# EAGLE design pcf8574 (EAGLE 7.1.0)
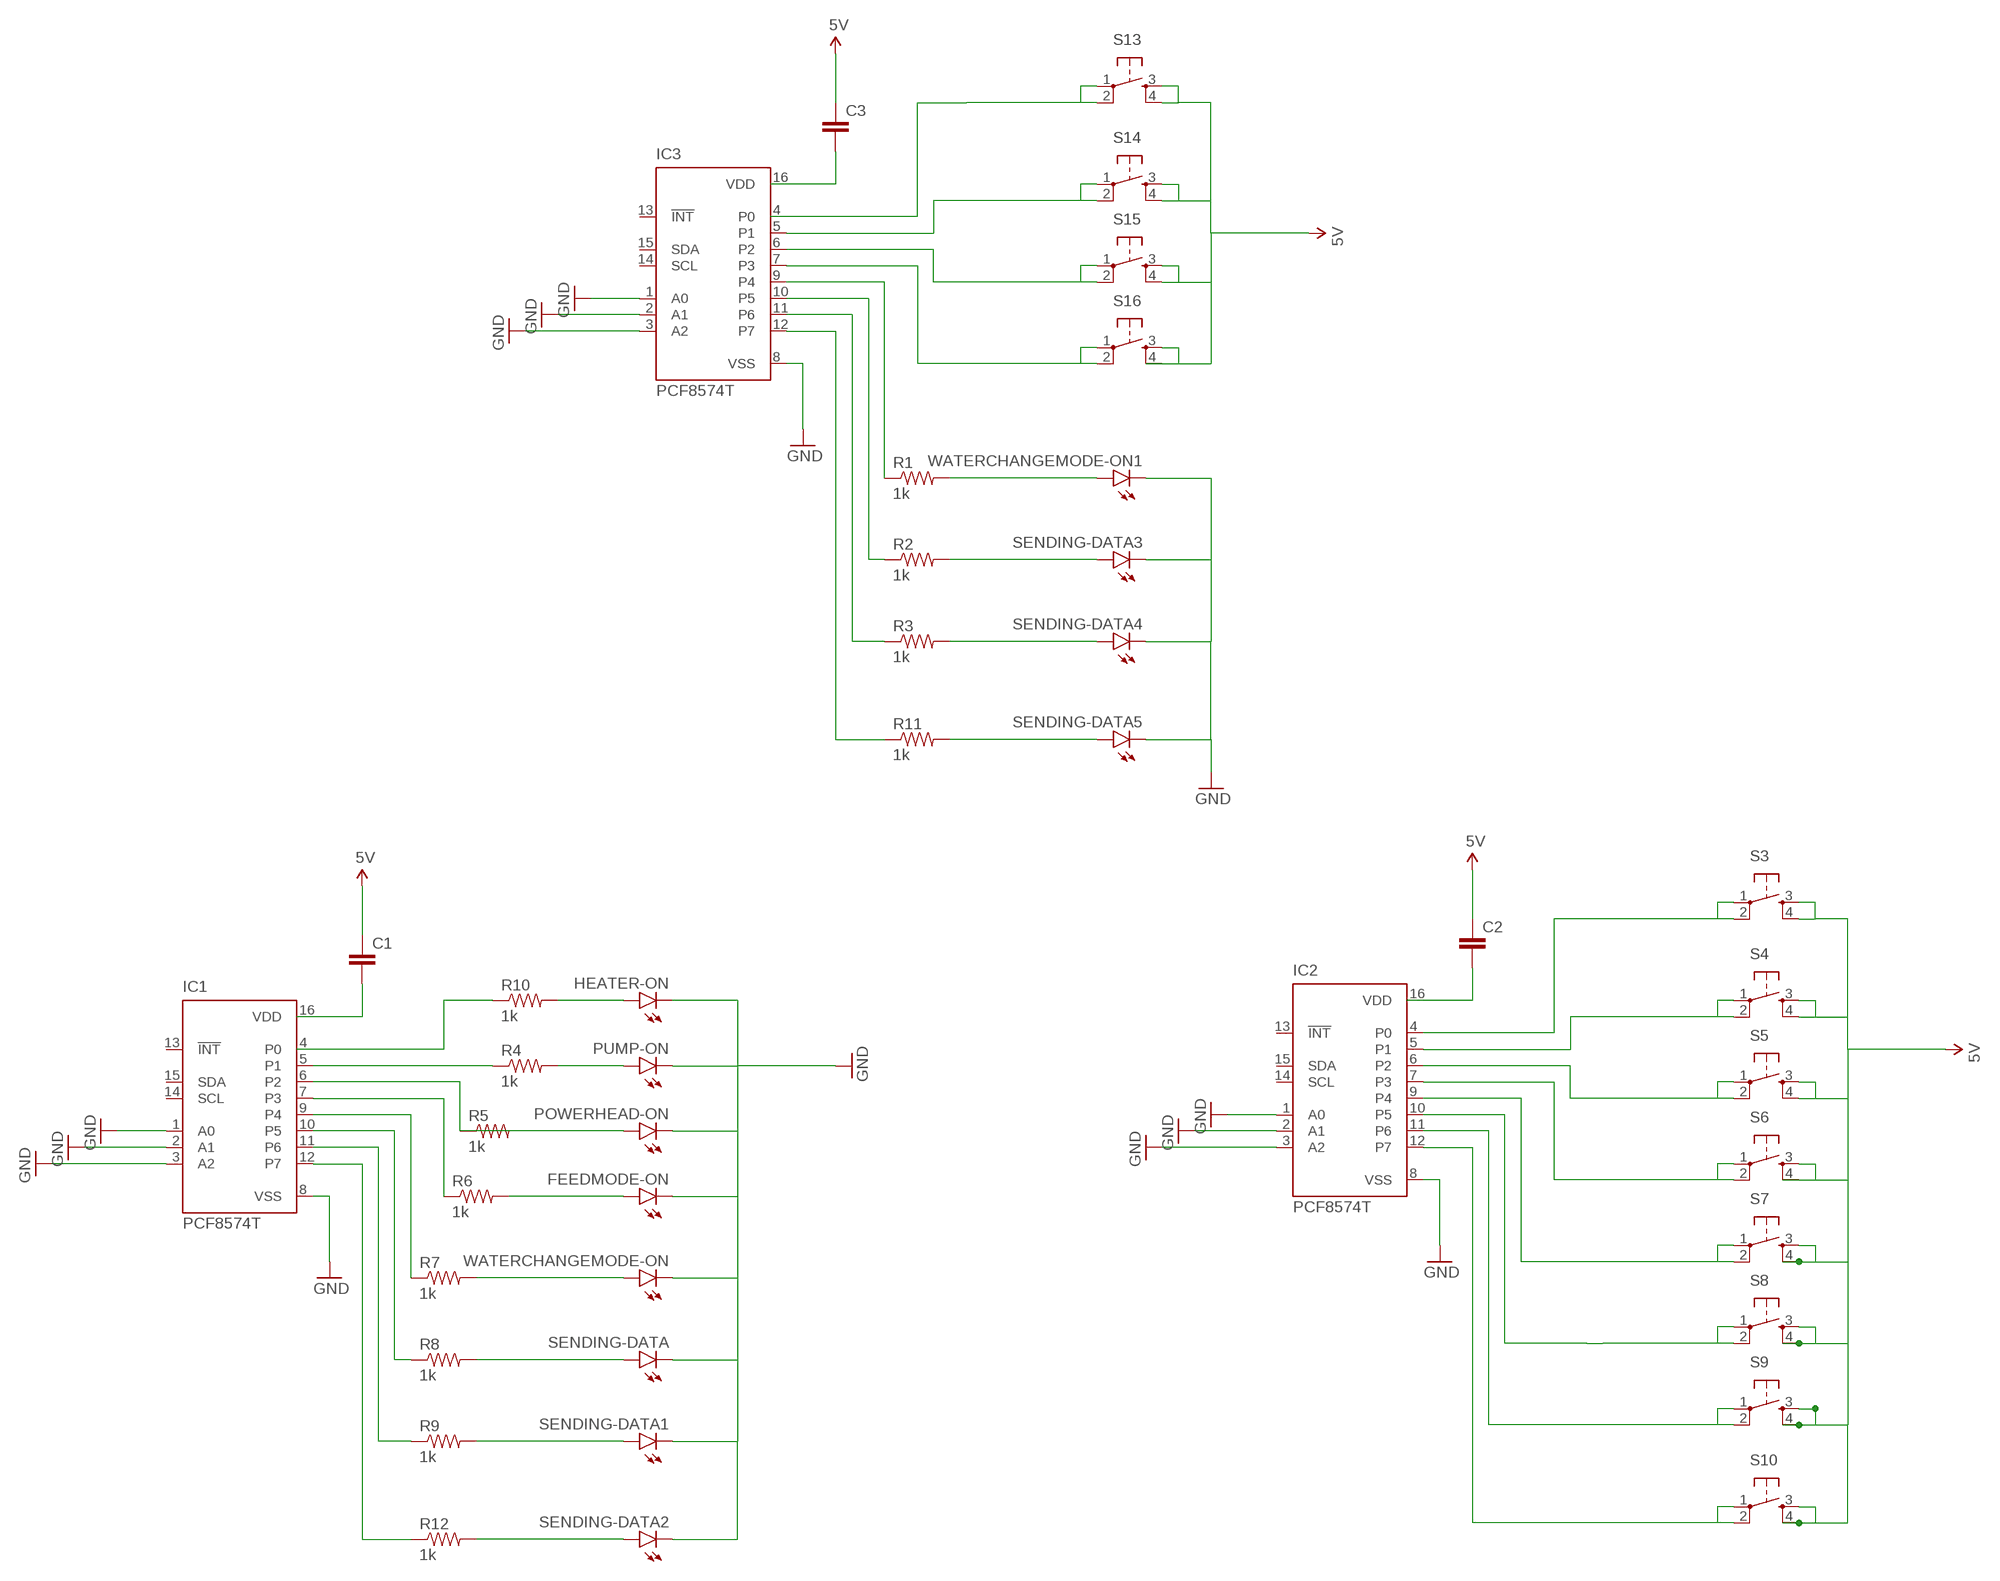
[diagram p0: schematic, sheet 1]

## Parts
C1  CAPPTH2  [CAP-PTH-SMALL2]
C2  CAPPTH2  [CAP-PTH-SMALL2]
C3  CAPPTH2  [CAP-PTH-SMALL2]
FEEDMODE-ON  LED3MM  [LED3MM]
HEATER-ON  LED3MM  [LED3MM]
IC1  PCF8574T  [SO16W]
IC2  PCF8574T  [SO16W]
IC3  PCF8574T  [SO16W]
POWERHEAD-ON  LED3MM  [LED3MM]
PUMP-ON  LED3MM  [LED3MM]
R1  1k  RESISTORAXIAL-0.3  [AXIAL-0.3]
R2  1k  RESISTORAXIAL-0.3  [AXIAL-0.3]
R3  1k  RESISTORAXIAL-0.3  [AXIAL-0.3]
R4  1k  RESISTORAXIAL-0.3  [AXIAL-0.3]
R5  1k  RESISTORAXIAL-0.3  [AXIAL-0.3]
R6  1k  RESISTORAXIAL-0.3  [AXIAL-0.3]
R7  1k  RESISTORAXIAL-0.3  [AXIAL-0.3]
R8  1k  RESISTORAXIAL-0.3  [AXIAL-0.3]
R9  1k  RESISTORAXIAL-0.3  [AXIAL-0.3]
R10  1k  RESISTORAXIAL-0.3  [AXIAL-0.3]
R11  1k  RESISTORAXIAL-0.3  [AXIAL-0.3]
R12  1k  RESISTORAXIAL-0.3  [AXIAL-0.3]
S3  TAC_SWITCHPTH  [TACTILE-PTH]
S4  TAC_SWITCHPTH  [TACTILE-PTH]
S5  TAC_SWITCHPTH  [TACTILE-PTH]
S6  TAC_SWITCHPTH  [TACTILE-PTH]
S7  TAC_SWITCHPTH  [TACTILE-PTH]
S8  TAC_SWITCHPTH  [TACTILE-PTH]
S9  TAC_SWITCHPTH  [TACTILE-PTH]
S10  TAC_SWITCHPTH  [TACTILE-PTH]
S13  TAC_SWITCHPTH  [TACTILE-PTH]
S14  TAC_SWITCHPTH  [TACTILE-PTH]
S15  TAC_SWITCHPTH  [TACTILE-PTH]
S16  TAC_SWITCHPTH  [TACTILE-PTH]
SENDING-DATA  LED3MM  [LED3MM]
SENDING-DATA1  LED3MM  [LED3MM]
SENDING-DATA2  LED3MM  [LED3MM]
SENDING-DATA3  LED3MM  [LED3MM]
SENDING-DATA4  LED3MM  [LED3MM]
SENDING-DATA5  LED3MM  [LED3MM]
WATERCHANGEMODE-ON  LED3MM  [LED3MM]
WATERCHANGEMODE-ON1  LED3MM  [LED3MM]

## Nets
5V: C1.1 C2.1 C3.1 S3.3 S3.4 S4.3 S4.4 S5.3 S5.4 S6.3 S6.4 S7.3 S7.4 S8.3 S8.4 S9.3 S9.4 S10.3 S10.4 S13.3 S13.4 S14.3 S14.4 S15.3 S15.4 S16.3 S16.4
GND: FEEDMODE-ON.K(C) HEATER-ON.K(C) IC1.1(A0) IC1.2(A1) IC1.3(A2) IC1.8(VSS) IC2.1(A0) IC2.2(A1) IC2.3(A2) IC2.8(VSS) IC3.1(A0) IC3.2(A1) IC3.3(A2) IC3.8(VSS) POWERHEAD-ON.K(C) PUMP-ON.K(C) SENDING-DATA1.K(C) SENDING-DATA2.K(C) SENDING-DATA3.K(C) SENDING-DATA4.K(C) SENDING-DATA5.K(C) SENDING-DATA.K(C) WATERCHANGEMODE-ON1.K(C) WATERCHANGEMODE-ON.K(C)
N$1: PUMP-ON.A R4.P$2
N$2: HEATER-ON.A R10.P$2
N$3: R9.P$2 SENDING-DATA1.A
N$4: R12.P$2 SENDING-DATA2.A
N$5: R8.P$2 SENDING-DATA.A
N$6: R7.P$2 WATERCHANGEMODE-ON.A
N$7: IC1.12(P7) R12.P$1
N$8: IC1.11(P6) R9.P$1
N$9: IC1.10(P5) R8.P$1
N$10: IC1.9(P4) R7.P$1
N$11: IC1.7(P3) R6.P$1
N$12: FEEDMODE-ON.A R6.P$2
N$13: IC1.6(P2) POWERHEAD-ON.A R5.P$1 R5.P$2
N$14: R10.P$1
N$15: IC1.5(P1) R4.P$1
N$16: C1.2
N$17: IC2.11(P6) S9.1 S9.2
N$18: IC2.12(P7) S10.1 S10.2
N$19: S8.1 S8.2
N$20: IC2.9(P4) S7.1 S7.2
N$21: IC3.11(P6) R3.P$1
N$22: IC3.12(P7) R11.P$1
N$23: IC2.10(P5)
N$25: IC3.9(P4) R1.P$1
N$26: IC2.7(P3) S6.1 S6.2
N$27: IC3.10(P5) R2.P$1
N$28: IC2.5(P1) S4.1 S4.2
N$29: IC2.4(P0) S3.1 S3.2
N$30: IC3.7(P3) S16.1 S16.2
N$31: IC3.5(P1) S14.1 S14.2
N$32: C2.2
N$33: IC2.6(P2) S5.1 S5.2
N$35: S13.1 S13.2
N$36: C3.2
N$37: IC3.6(P2) S15.1 S15.2
N$39: R3.P$2 SENDING-DATA4.A
N$43: R11.P$2 SENDING-DATA5.A
N$44: R2.P$2 SENDING-DATA3.A
N$45: R1.P$2 WATERCHANGEMODE-ON1.A
Unconnected: IC1.4(P0) IC1.13(!INT) IC1.14(SCL) IC1.15(SDA) IC2.13(!INT) IC2.14(SCL) IC2.15(SDA) IC3.4(P0) IC3.13(!INT) IC3.14(SCL) IC3.15(SDA)

## Power pins joined to a net without a drawn wire
VDD: IC1.16(VDD) IC2.16(VDD) IC3.16(VDD)

## Library data of the parts
C1-C3 = SparkFun-Capacitors:CAP: Capacitor Standard 0603 ceramic capacitor, and 0.1" leaded capacitor.
FEEDMODE-ON HEATER-ON POWERHEAD-ON PUMP-ON SENDING-DATA SENDING-DATA1-SENDING-DATA5 WATERCHANGEMODE-ON WATERCHANGEMODE-ON1 = SparkFun-LED:LED: LEDs Standard schematic elements and footprints for 5mm, 3mm, 1206, and 0603 sized LEDs. 5mm - Spark Fun Electronics SKU : COM-00529 (and others)
IC1-IC3 = micro-philips:PCF8574: I2C-Bus Remote 8-bit I/O expander http://www.semiconductors.philips.com/acrobat_download/datasheets/PCF8574_4.pdf
R1-R12 = SparkFun-Resistors:RESISTOR: Resistor Basic schematic elements and footprints for 0603, 1206, and PTH resistors.
S3-S10 S13-S16 = SparkFun-Electromechanical:TAC_SWITCH: Momentary Switch Button commonly used for reset or general input. Spark Fun Electronics SKU : COM-00097 SMT- SWCH-08247

## Board
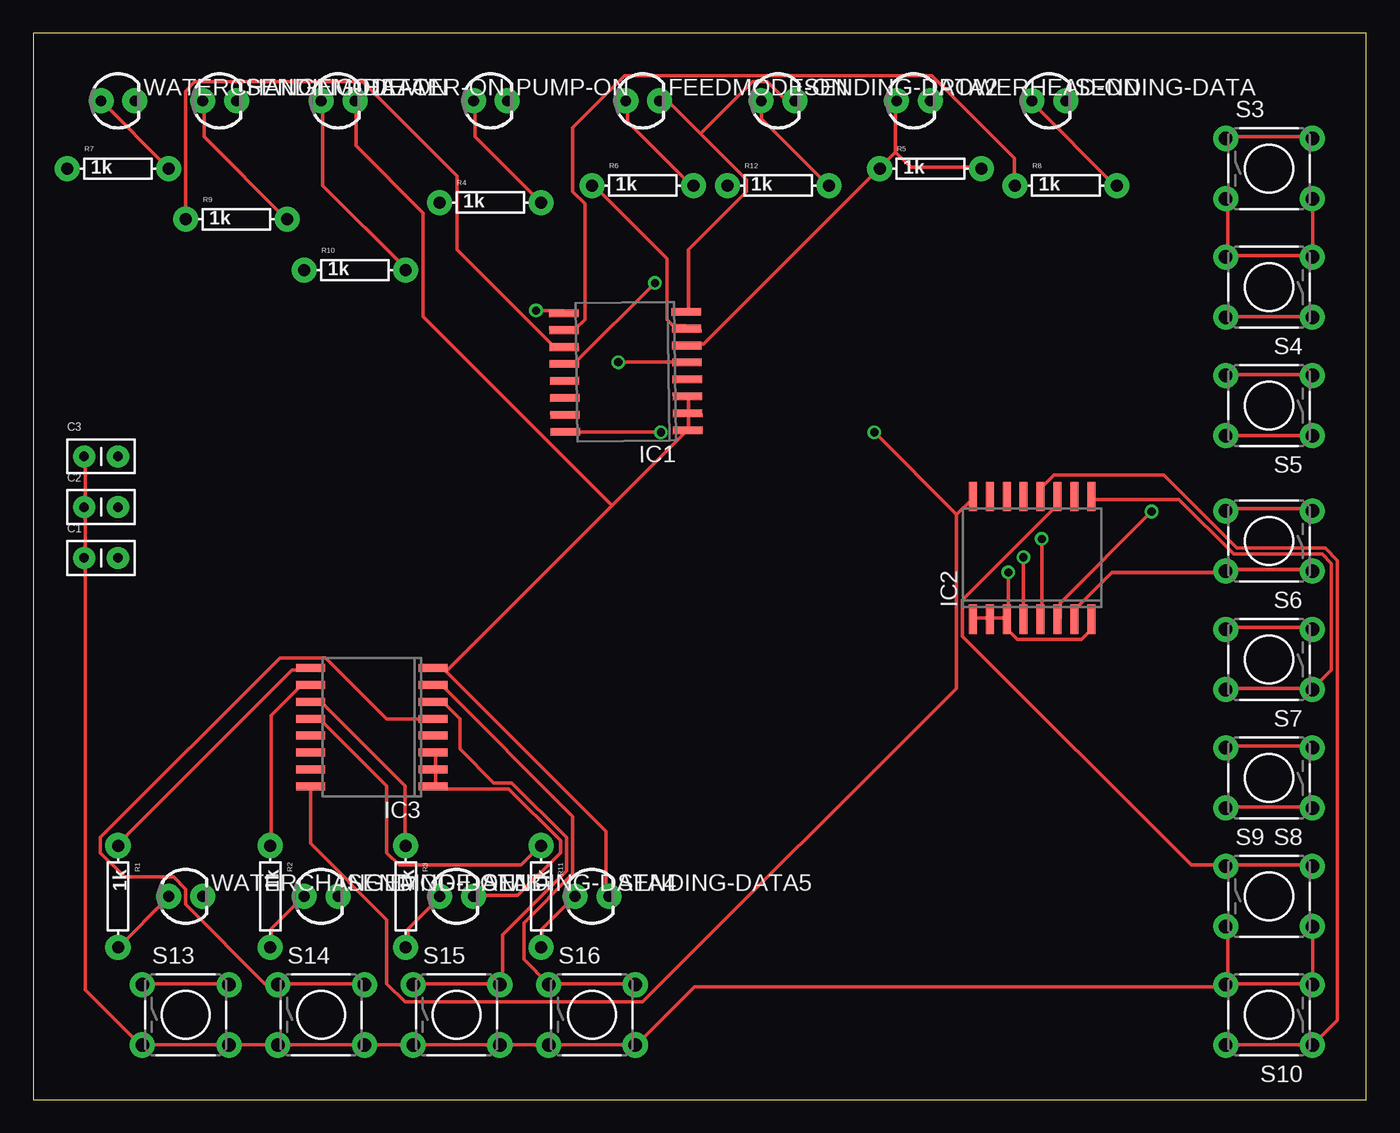
[diagram p1: board, top side]
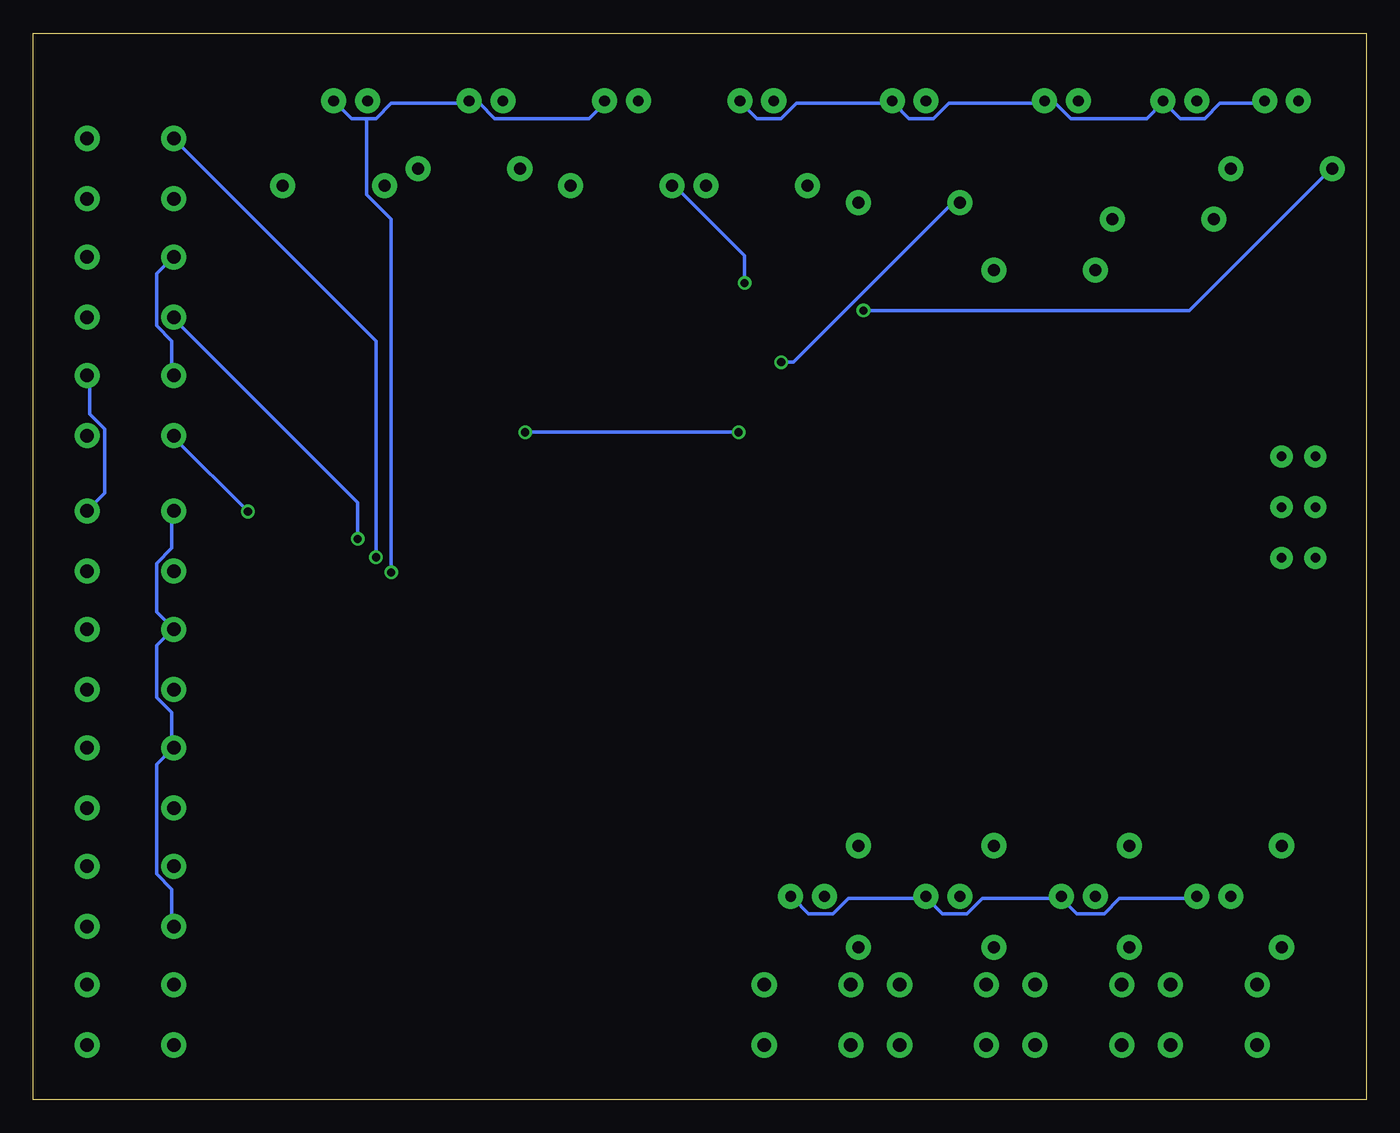
[diagram p2: board, bottom side, seen from below]

Size 100 x 80 mm. Coordinates in mm from the lower left corner, seen from the top.
Outline: 0,0 100,0 100,80 0,80 0,0
Copper layers (1*16): Top 0.035mm / dielectric 1.5mm / Bottom 0.035mm
Design rules "default": minimum track width 10mil, minimum drill 24mil, track to track 8mil, track to pad 8mil, pad to pad 8mil, via to via 8mil, smd to smd 8mil, copper to edge 40mil, drill to drill 8mil, minimum pad ring 10mil, minimum via ring 8mil, stop-mask expansion 4mil, vias tented up to drill 0mil, thermal gap 10mil

### Footprints (pad centres in the part's own frame; a part is rotated, then mirrored left to right if it is on the bottom)
CAP-PTH-SMALL2 = drill 0.7 pad 1.651: 1 0,0; 2 2.54,0
LED3MM = drill 0.813 pad 1.88: A -1.27,0; K 1.27,0
SO16W = smd 0.6 x 2.2: 1 -4.445,-4.6; 2 -3.175,-4.6; 3 -1.905,-4.6; 4 -0.635,-4.6; 5 0.635,-4.6; 6 1.905,-4.6; 7 3.175,-4.6; 8 4.445,-4.6; 9 4.445,4.6; 10 3.175,4.6; 11 1.905,4.6; 12 0.635,4.6; 13 -0.635,4.6; 14 -1.905,4.6; 15 -3.175,4.6; 16 -4.445,4.6
AXIAL-0.3 = drill 0.9 pad 1.88: P$1 -3.81,0; P$2 3.81,0
TACTILE-PTH = drill 1.016 pad 1.88: 1 -3.251,2.261; 2 3.251,2.261; 3 -3.251,-2.261; 4 3.251,-2.261

### Placement (x,y rotation side)
C1  3.81,40.64 0 top
C2  3.81,44.45 0 top
C3  3.81,48.26 0 top
FEEDMODE-ON  45.72,74.93 0 top
HEATER-ON  22.86,74.93 0 top
IC1  44.45,54.61 90.7 top
IC2  74.93,40.64 0 top
IC3  25.4,27.94 90 top
POWERHEAD-ON  66.04,74.93 0 top
PUMP-ON  34.29,74.93 0 top
R1  6.35,15.24 270 top
R2  17.78,15.24 270 top
R3  27.94,15.24 270 top
R4  34.29,67.31 0 top
R5  67.31,69.85 0 top
R6  45.72,68.58 0 top
R7  6.35,69.85 0 top
R8  77.47,68.58 0 top
R9  15.24,66.04 0 top
R10  24.13,62.23 0 top
R11  38.1,15.24 270 top
R12  55.88,68.58 0 top
S3  92.71,69.85 0 top
S4  92.71,60.96 180 top
S5  92.71,52.07 180 top
S6  92.71,41.91 180 top
S7  92.71,33.02 180 top
S8  92.71,24.13 180 top
S9  92.71,15.24 0 top
S10  92.71,6.35 180 top
S13  11.43,6.35 0 top
S14  21.59,6.35 0 top
S15  31.75,6.35 0 top
S16  41.91,6.35 0 top
SENDING-DATA  76.2,74.93 0 top
SENDING-DATA1  13.97,74.93 0 top
SENDING-DATA2  55.88,74.93 0 top
SENDING-DATA3  21.59,15.24 0 top
SENDING-DATA4  31.75,15.24 0 top
SENDING-DATA5  41.91,15.24 0 top
WATERCHANGEMODE-ON  6.35,74.93 0 top
WATERCHANGEMODE-ON1  11.43,15.24 0 top

### Tracks (layer width: path | path; a pad name or v marks a point on that pad's centre or on a via)
5V
  Top 0.254: S5.4 89.61,54.41 95.78,54.41 S5.3 | 89.61,63.32 89.61,67.44 S3.3 | S3.4 96.01,67.44 96.01,63.32 S4.3 95.78,63.32 89.61,63.32 | 89.61,63.32 S4.4 | 89.61,8.69 89.61,12.8 S9.3 | S9.4 96.01,12.8 96.01,8.69 S10.3 95.78,8.69 89.61,8.69 | 89.61,8.69 S10.4 89.38,8.46 49.61,8.46 45.26,4.12 S16.4 45.03,4.12 38.86,4.12 S16.3 38.63,4.12 35.2,4.12 S15.4 34.98,4.12 28.57,4.12 S15.3 28.35,4.12 24.92,4.12 S14.4 24.69,4.12 18.52,4.12 S14.3 18.29,4.12 14.86,4.12 S13.4 14.63,4.12 8.23,4.12 S13.3 8,4.12 3.89,8.23 3.89,40.46 C1.1 3.89,40.69 3.89,44.35 C2.1 3.89,44.58 3.89,48.23 C3.1 | S6.4 89.61,44.35 95.78,44.35 S6.3 | S8.4 89.61,26.52 95.78,26.52 S8.3 | S7.4 89.61,35.43 95.78,35.43 S7.3
  Bottom 0.254: S5.4 89.61,54.41 89.61,56.92 90.75,58.06 90.75,61.95 89.61,63.09 S4.4 | S6.4 89.61,44.12 89.61,41.38 90.75,40.23 90.75,36.58 S7.4 89.61,35.2 90.75,34.06 90.75,30.18 89.61,29.03 89.61,26.52 S8.4 89.61,26.29 90.75,25.15 90.75,16.92 89.61,15.77 89.61,13.03 S9.3 | S6.3 94.64,45.49 94.64,50.29 95.78,51.44 95.78,54.18 S5.3
GND  (via drill 0.61)
  Top 0.254: IC3.3 30.18,25.83 30.18,24.92 IC3.2 30.18,24.69 30.18,23.55 IC3.1 30.18,23.32 35.66,23.32 39.55,19.43 39.55,18.52 36.35,15.32 33.15,15.32 SENDING-DATA4.K | IC1.3 49.15,52.58 49.15,51.66 IC1.2 49.15,51.44 49.15,50.29 IC1.1 48.92,50.06 43.43,44.58 | 30.86,32.23 30.18,32.23 IC3.8 30.86,32.23 | 30.86,32.23 42.98,20.12 42.98,15.32 SENDING-DATA5.K | 43.43,44.58 31.09,32.23 30.86,32.23 | IC2.1 70.64,36.12 71.55,36.12 IC2.2 71.78,36.12 72.92,36.12 IC2.3 | IC2.8 79.32,35.89 79.32,35.2 78.64,34.52 73.84,34.52 73.15,35.2 73.15,35.89 IC2.3 | v73.15,39.55 73.15,36.12 IC2.3 | 50.06,72.47 47.78,74.75 47.09,74.75 FEEDMODE-ON.K | 50.06,72.47 53.49,69.04 53.49,68.12 49.15,63.78 49.15,59.21 IC1.8 | 50.06,72.47 53.95,76.35 55.09,76.35 56.46,74.98 57.15,74.98 SENDING-DATA2.K | 43.43,44.58 29.26,58.75 29.26,66.52 24.23,71.55 24.23,74.75 HEATER-ON.K
  Bottom 0.254: 22.86,15.09 21.72,13.95 19.66,13.95 18.52,15.09 12.8,15.09 WATERCHANGEMODE-ON1.K | 22.86,15.09 28.8,15.09 29.95,13.95 31.77,13.95 32.92,15.09 SENDING-DATA4.K 33.15,15.09 38.86,15.09 40.01,13.95 41.83,13.95 42.98,15.09 SENDING-DATA5.K | 22.86,15.09 SENDING-DATA3.K | 74.98,73.61 76.12,73.61 77.27,74.75 SENDING-DATA.K | 74.98,73.61 74.3,73.61 73.15,74.75 67.44,74.75 POWERHEAD-ON.K 67.21,74.75 66.52,74.75 65.38,73.61 58.29,73.61 57.15,74.75 SENDING-DATA2.K | v73.15,39.55 73.15,66.06 74.98,67.89 74.98,73.61 | WATERCHANGEMODE-ON.K 7.77,74.75 10.97,74.75 12.12,73.61 13.95,73.61 15.09,74.75 SENDING-DATA1.K 15.32,74.75 16.46,73.61 22.17,73.61 23.32,74.75 24,74.75 HEATER-ON.K 24.23,74.75 31.32,74.75 32.46,73.61 34.29,73.61 35.43,74.75 PUMP-ON.K 35.66,74.75 42.75,74.75 43.89,73.61 45.72,73.61 46.86,74.75 FEEDMODE-ON.K
N$1
  Top 0.254: PUMP-ON.A 33.15,74.75 33.15,72.24 37.95,67.44 R4.P$2
N$2
  Top 0.254: HEATER-ON.A 21.72,74.75 21.72,68.58 27.89,62.41 R10.P$2
N$3
  Top 0.254: SENDING-DATA1.A 12.8,74.75 12.8,72.24 18.97,66.06 R9.P$2
N$4
  Top 0.254: SENDING-DATA2.A 54.63,74.75 54.63,73.61 59.66,68.58 R12.P$2
N$5
  Top 0.254: R8.P$2 81.15,68.58 74.98,74.75 SENDING-DATA.A
N$6
  Top 0.254: R7.P$2 WATERCHANGEMODE-ON.A
N$7  (via drill 0.61)
  Top 0.254: v46.63,61.27 40.69,55.32 40.01,55.32 IC1.12
  Bottom 0.254: v46.63,61.27 46.63,63.32 51.89,68.58 R12.P$1
N$8
  Top 0.254: R9.P$1 11.43,75.67 12.12,76.35 24.69,76.35 31.77,69.27 31.77,63.78 39.09,56.46 39.78,56.46 IC1.11
N$9
  Top 0.254: IC1.10 40.01,57.84 40.69,57.84 41.38,58.52 41.38,67.21 40.46,68.12 40.46,72.92 44.35,76.81 67.44,76.81 73.61,70.64 73.61,68.58 R8.P$1
N$10  (via drill 0.61)
  Top 0.254: v37.72,59.21 39.78,59.21 IC1.9
  Bottom 0.254: v37.72,59.21 13.26,59.21 2.74,69.72 R7.P$1
N$11
  Top 0.254: IC1.7 48.92,58.06 48.01,58.06 47.55,58.52 47.55,63.09 42.06,68.58 R6.P$1
N$12
  Top 0.254: FEEDMODE-ON.A 44.58,74.75 44.58,73.38 49.38,68.58 R6.P$2
N$13
  Top 0.254: IC1.6 49.15,56.69 50.29,56.69 63.32,69.72 R5.P$1 63.55,69.95 64.69,71.09 | 64.69,71.09 64.69,74.75 POWERHEAD-ON.A | 64.69,71.09 65.84,69.95 71.09,69.95 R5.P$2
N$15  (via drill 0.61)
  Top 0.254: v43.89,55.32 48.92,55.32 IC1.5
  Bottom 0.254: v43.89,55.32 42.98,55.32 31.09,67.21 30.63,67.21 R4.P$1
N$17
  Top 0.254: IC2.11 76.81,45.03 76.81,44.58 69.72,37.49 69.72,34.75 86.87,17.6 89.38,17.6 S9.1 89.61,17.6 95.78,17.6 S9.2
N$18
  Top 0.254: IC2.12 75.67,45.26 75.67,45.95 76.58,46.86 84.81,46.86 90.3,41.38 96.93,41.38 97.84,40.46 97.84,5.94 96.01,4.12 S10.1 95.78,4.12 89.61,4.12 S10.2
N$19
  Top 0.254: S8.2 89.61,21.95 95.78,21.95 S8.1
N$20
  Top 0.254: IC2.9 79.55,45.03 85.95,45.03 90.07,40.92 96.7,40.92 97.38,40.23 97.38,32.23 96.01,30.86 S7.1 95.78,30.86 89.61,30.86 S7.2
N$21
  Top 0.254: IC3.11 20.8,29.72 21.72,29.72 27.89,23.55 27.89,19.2 R3.P$1
N$22
  Top 0.254: IC3.12 21.49,28.57 26.52,23.55 26.52,18.52 27.43,17.6 36.58,17.6 37.95,18.97 R11.P$1
N$25
  Top 0.254: IC3.9 20.57,32.23 19.43,32.23 6.4,19.2 R1.P$1
N$26
  Top 0.254: IC2.7 78.18,36.12 78.18,36.8 80.92,39.55 89.38,39.55 S6.2 89.61,39.78 95.78,39.78 S6.1
N$27
  Top 0.254: IC3.10 20.57,31.09 20.12,31.09 17.83,28.8 17.83,19.2 R2.P$1
N$28  (via drill 0.61)
  Top 0.254: v75.67,42.06 75.67,36.12 IC2.5 | S4.1 95.78,58.75 89.61,58.75 S4.2
  Bottom 0.254: v75.67,42.06 75.67,44.81 89.38,58.52 S4.2
N$29  (via drill 0.61)
  Top 0.254: v74.3,40.69 IC2.4 | S3.2 95.78,72.24 89.61,72.24 S3.1
  Bottom 0.254: v74.3,40.69 74.3,56.92 89.38,72.01 S3.1
N$30
  Top 0.254: IC3.7 30.18,31.09 30.63,31.09 40.46,21.26 40.46,16.92 36.8,13.26 36.8,10.52 38.63,8.69 S16.1 38.86,8.69 45.03,8.69 S16.2
N$31
  Top 0.254: IC3.5 26.52,28.57 21.95,33.15 18.52,33.15 5.03,19.66 5.03,18.52 6.86,16.69 10.52,16.69 11.43,15.77 11.43,14.63 17.37,8.69 18.29,8.69 S14.1 18.52,8.69 24.69,8.69 S14.2
N$33  (via drill 0.61)
  Top 0.254: v83.9,44.12 77.04,37.26 77.04,36.12 IC2.6 | S5.1 95.78,49.84 89.61,49.84 S5.2
  Bottom 0.254: v83.9,44.12 89.38,49.61 S5.2
N$35
  Top 0.254: S13.1 8.23,8.69 14.63,8.69 S13.2
N$37
  Top 0.254: IC3.6 30.18,29.72 30.86,29.72 32,28.57 32,26.29 34.52,23.77 35.89,23.77 40.01,19.66 40.01,17.14 35.2,12.34 35.2,8.69 S15.2 34.98,8.69 28.57,8.69 S15.1
N$39
  Top 0.254: R3.P$2 28.12,11.43 28.12,12.8 30.4,15.09 SENDING-DATA4.A
N$43
  Top 0.254: R11.P$2 38.18,11.43 38.18,12.8 40.46,15.09 SENDING-DATA5.A
N$44
  Top 0.254: R2.P$2 17.83,11.43 17.83,12.8 20.12,15.09 SENDING-DATA3.A
N$45
  Top 0.254: R1.P$2 6.4,11.43 10.06,15.09 WATERCHANGEMODE-ON1.A
VDD  (via drill 0.61)
  Top 0.254: 69.27,43.89 69.27,30.86 45.72,7.32 27.89,7.32 26.52,8.69 26.52,13.49 20.8,19.2 20.8,23.32 IC3.16 | 69.27,43.89 70.41,45.03 IC2.16 | v47.09,50.06 40.01,50.06 IC1.16 | 69.27,43.89 v63.09,50.06
  Bottom 0.254: v63.09,50.06 v47.09,50.06